# EAGLE board LED-plus20-SHIM (EAGLE 9.6.2), part 1 of 2
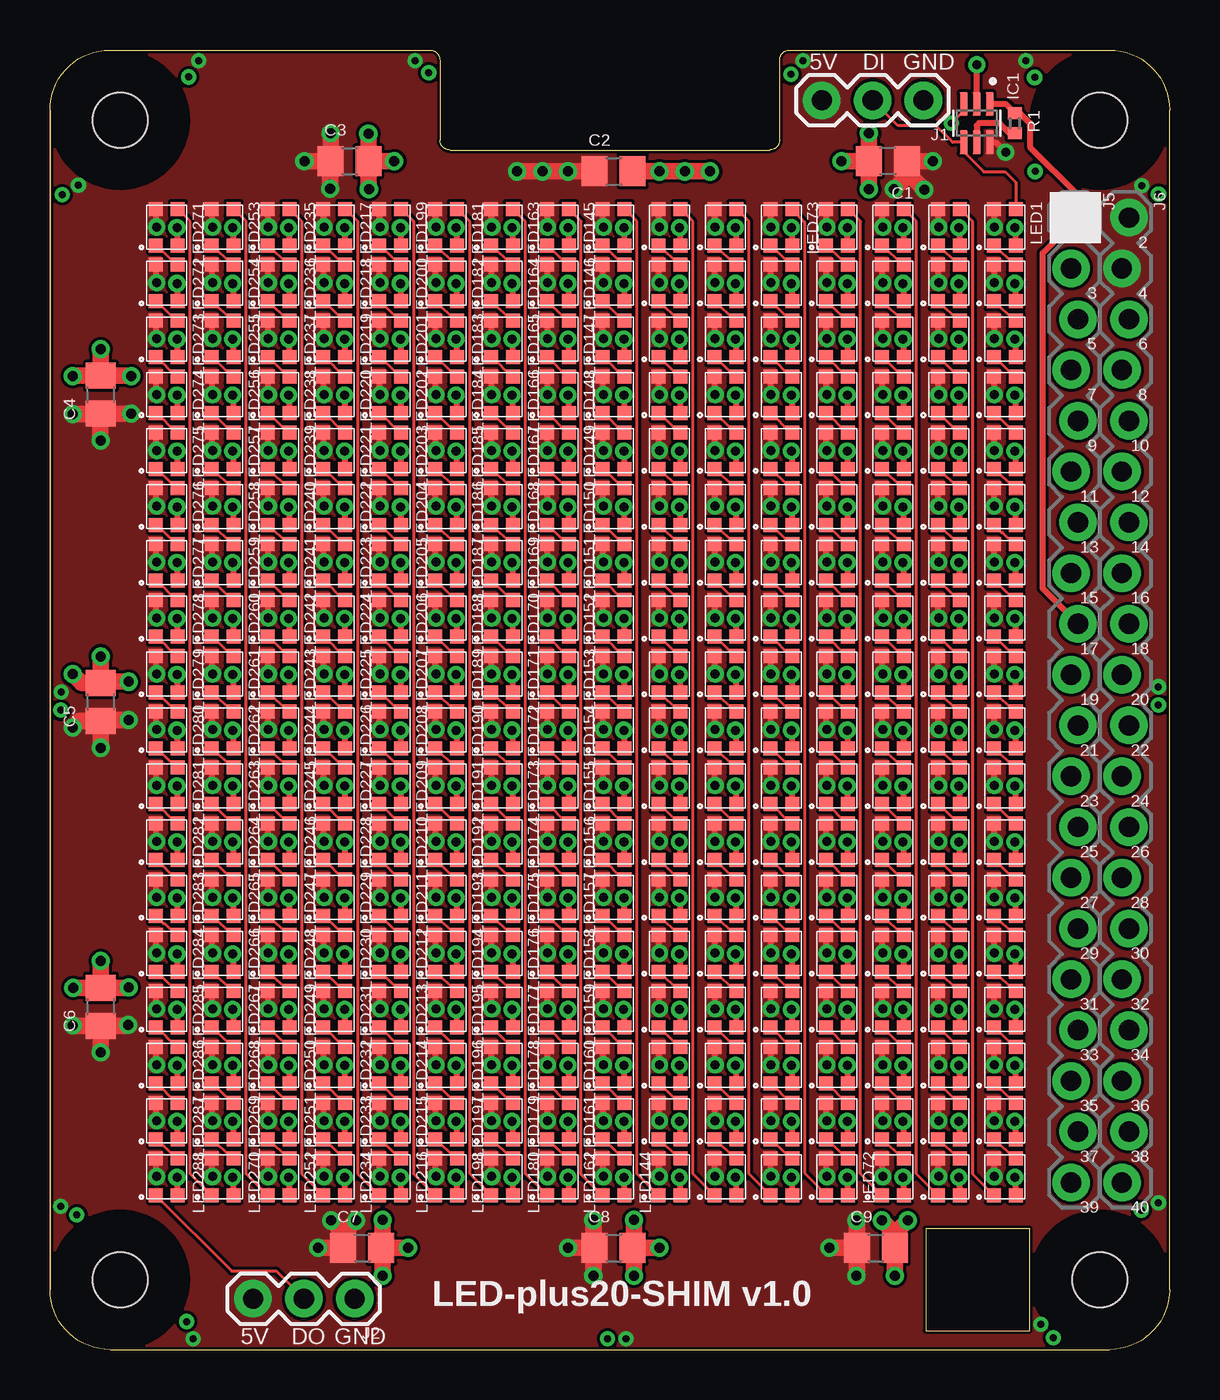
[diagram p4: board, top side]
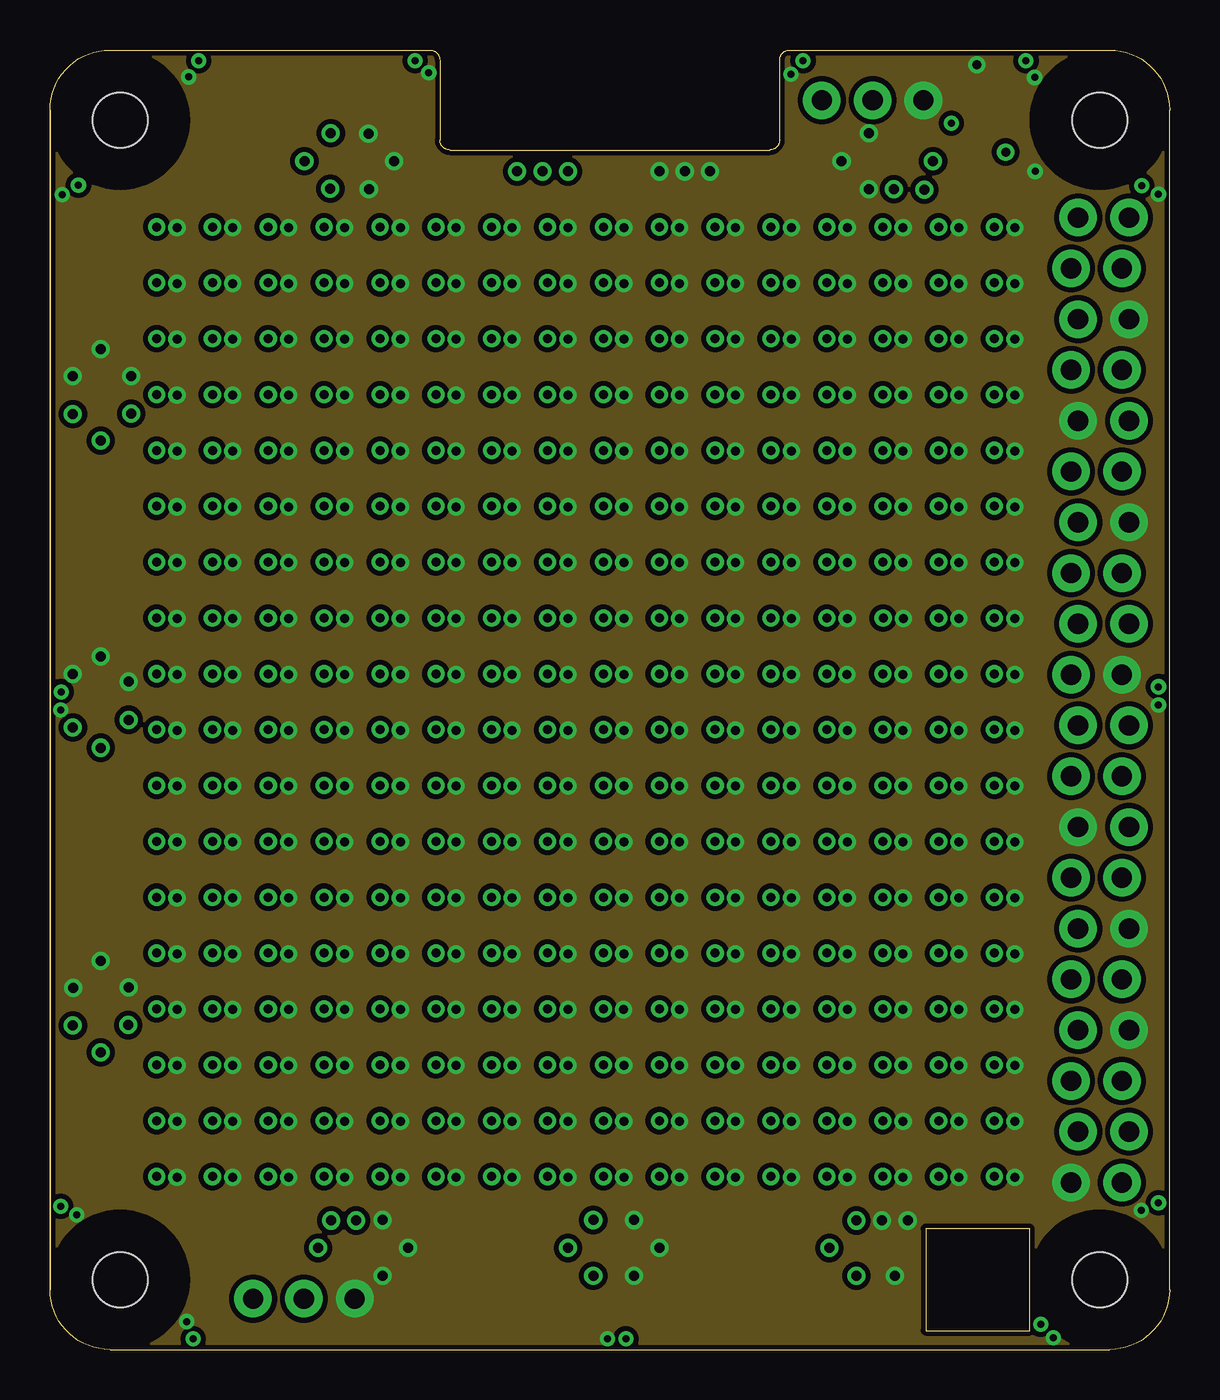
[diagram p5: board, inner layer Route2]
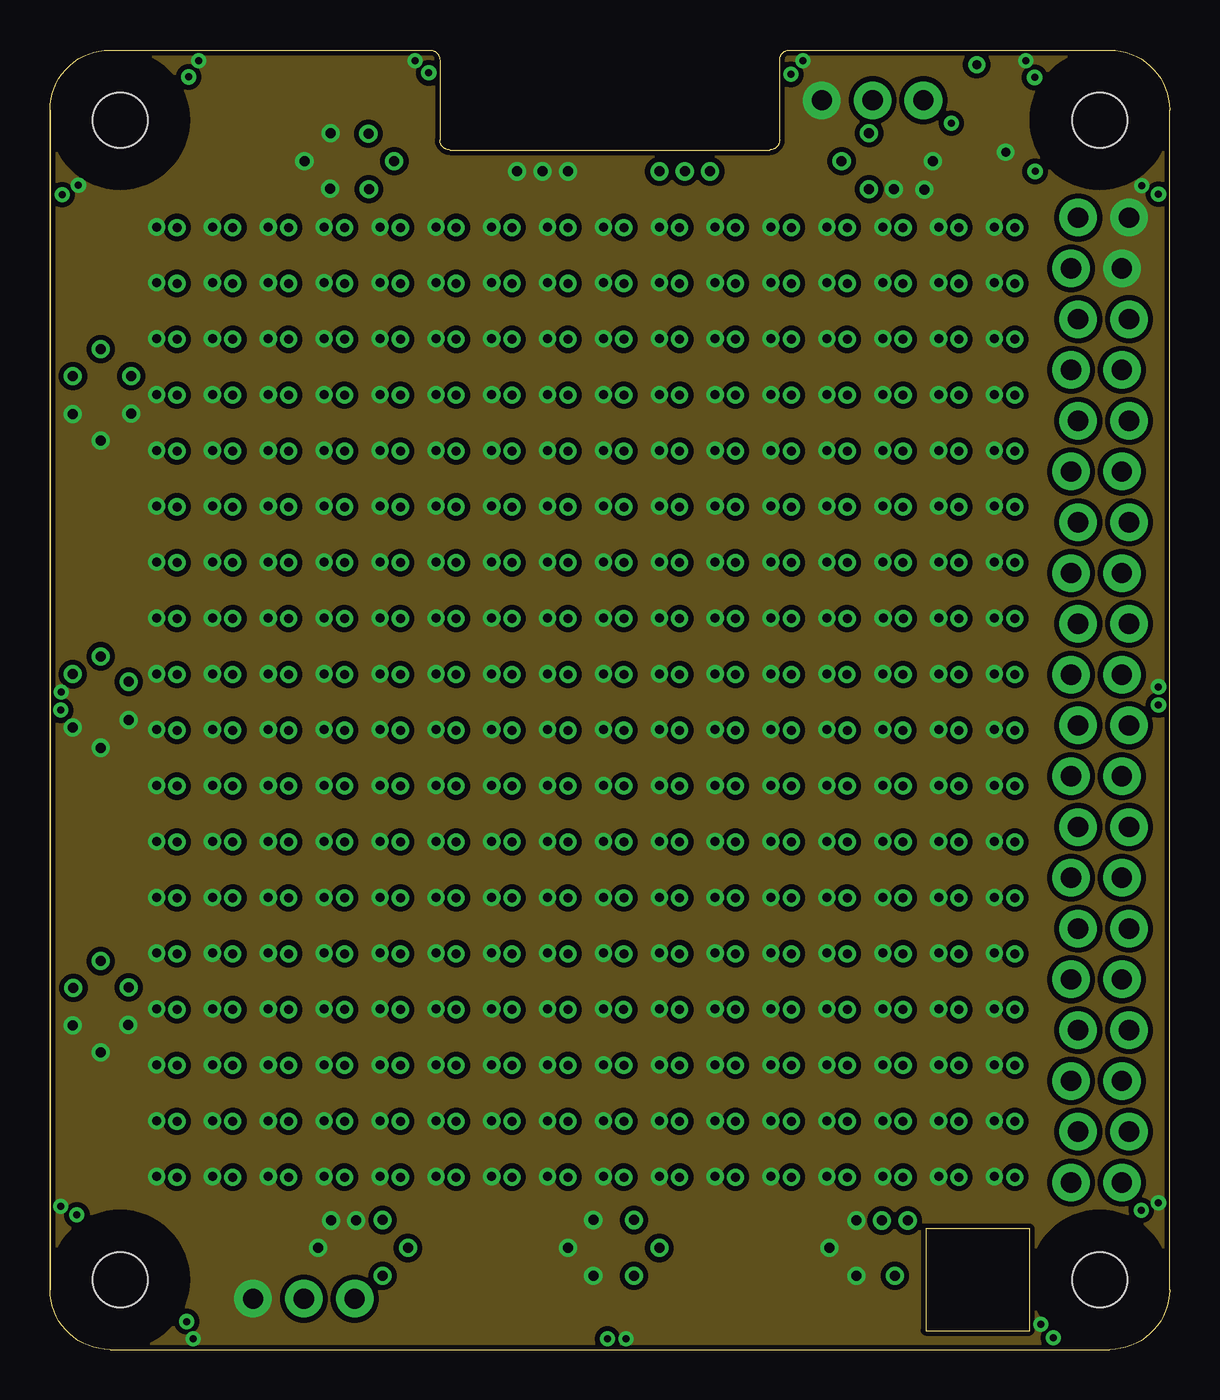
[diagram p6: board, inner layer Route15]
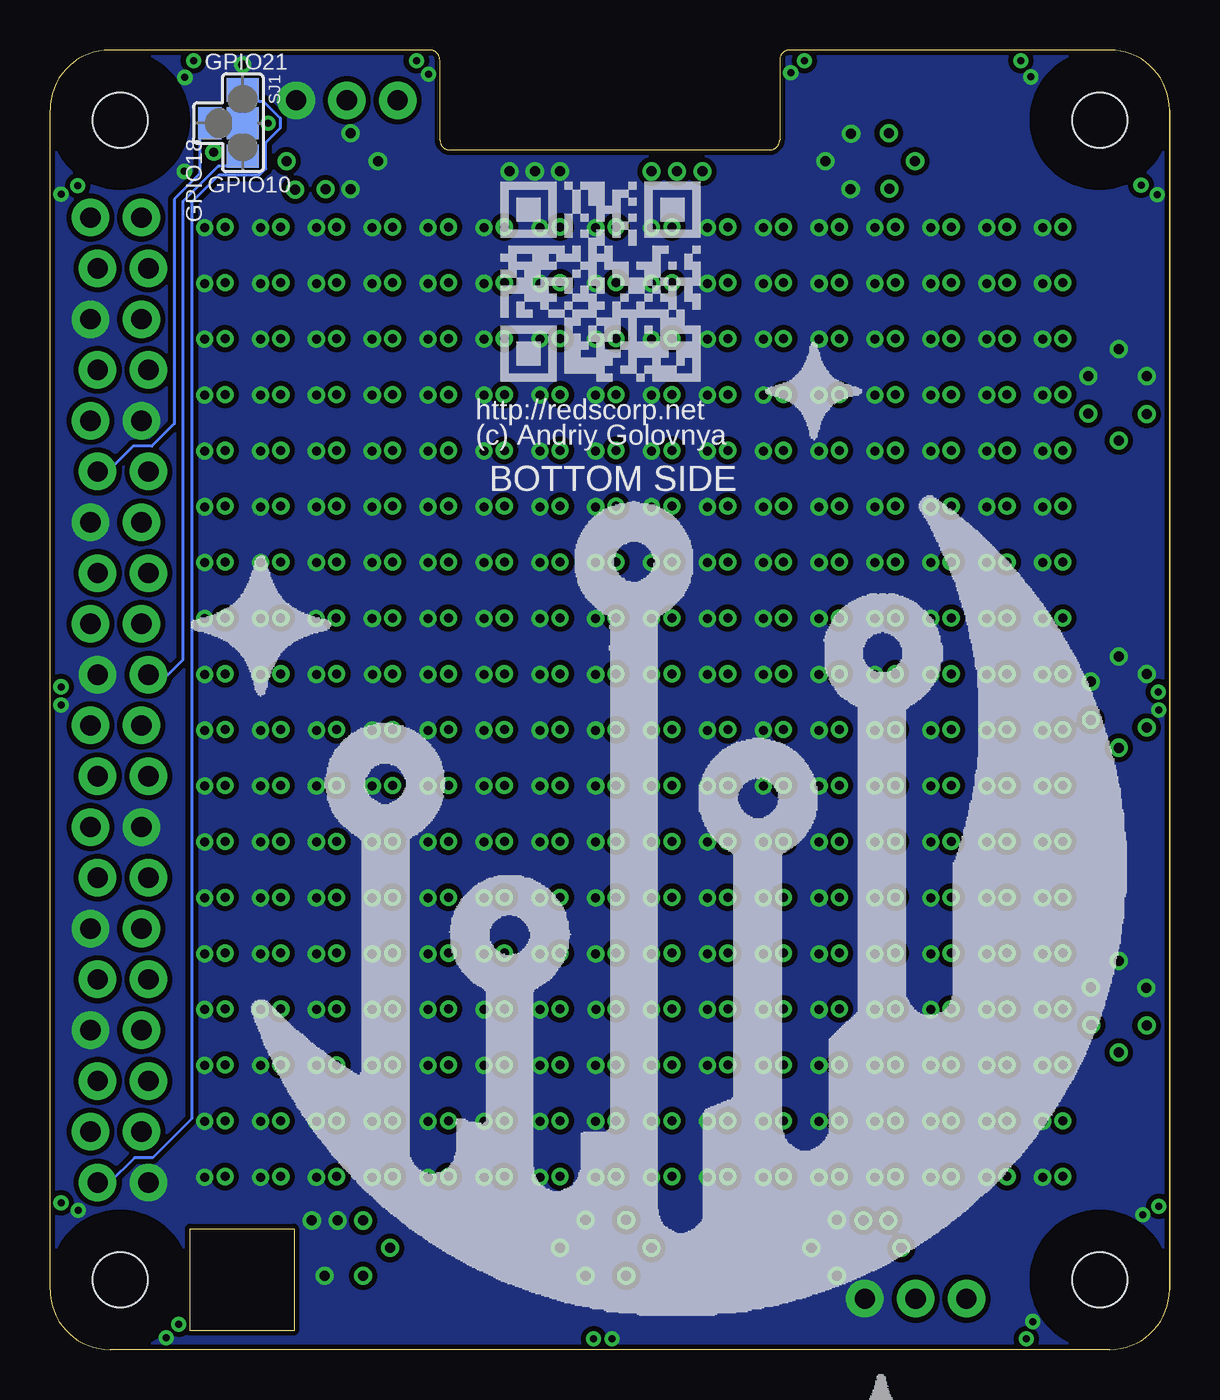
[diagram p7: board, bottom side, seen from below]

Size 56 x 65 mm. Coordinates in mm from the lower left corner, seen from the top.
Outline: 0,3 arc0 0,3 0,62 arc0 0,62
Outline: 0,62 0,3
Outline: 0,3 arc90 3,0 53,0 arc90 56,3 56,62 arc90 53,65 37,65 arc90 36.5,64.5 36.5,60.5 arc-90 36,60 20,60 arc-90 19.5,60.5 19.5,64.5 arc90 19,65 3,65 arc90 0,62
Outline: 43.8,0.95 49,0.95 49,6.05 43.8,6.05 43.8,0.95
Copper layers (1+2*15+16): Top 0.035mm / dielectric 0.2mm / Route2 0.035mm / dielectric 1.5mm / Route15 0.035mm / dielectric 0.2mm / Bottom 0.035mm
Design rules "default *": minimum track width 6mil, minimum drill 0.35mm, track to track 6mil, track to pad 6mil, pad to pad 6mil, via to via 6mil, smd to smd 6mil, copper to edge 6mil, drill to drill 6mil, minimum pad ring 10mil, minimum via ring 8mil, stop-mask expansion 4mil, vias tented up to drill 20mil, thermal gap 10mil
Holes 2.75 mm at 3.5,3.5 52.5,3.5 3.5,61.5 52.5,61.5

## Footprints (pad centres in the part's own frame; a part is rotated, then mirrored left to right if it is on the bottom)
C0805 = smd 1.3 x 1.5: 1 -0.95,0; 2 0.95,0
SOT65P210X110-6N = smd 1.19 x 0.4: 1 -0.96,0.65; 2 -0.96,0; 3 -0.96,-0.65; 4 0.96,-0.65; 5 0.96,0; 6 0.96,0.65
1X03 = drill 1.016 pad 1.88: 1 0,0; 2 2.54,0; 3 5.08,0
1X20_LOCK = drill 1.016 pad 1.88: 1 0,0.178; 2 2.54,-0.178; 3 5.08,0.178; 4 7.62,-0.178; 5 10.16,0.178; 6 12.7,-0.178; 7 15.24,0.178; 8 17.78,-0.178; 9 20.32,0.178; 10 22.86,-0.178; 11 25.4,0.178; 12 27.94,-0.178; 13 30.48,0.178; 14 33.02,-0.178; 15 35.56,0.178; 16 38.1,-0.178; 17 40.64,0.178; 18 43.18,-0.178; 19 45.72,0.178; 20 48.26,-0.178
WS2812X-2020 = smd 0.7 x 0.7: DI -0.915,0.55; DO 0.915,-0.55; GND 0.915,0.55; VDD -0.915,-0.55
R0402 = smd 0.6 x 0.7: 1 -0.5,0; 2 0.5,0
SJ_3 = smd 1.168 x 1.6: 1 -1.651,0; 3 1.651,0 | smd 1.6 x 1.6: 2 0,0 | smd 1.6 x 1.168: 4 0,-1.651

## Placement (x,y rotation side)
C1  10uF  [C0805]  41.91,59.44 180 top
C2  10uF  [C0805]  28.19,58.93 0 top
C3  10uF  [C0805]  14.99,59.44 0 top
C4  10uF  [C0805]  2.54,47.75 90 top
C5  10uF  [C0805]  2.54,32.38 90 top
C6  10uF  [C0805]  2.54,17.14 90 top
C7  10uF  [C0805]  15.62,5.08 0 top
C8  10uF  [C0805]  28.19,5.08 0 top
C9  10uF  [C0805]  41.3,5.08 0 top
IC1  TXB0101DCKR  [SOT65P210X110-6N]  46.36,61.34 270 top
J1  [1X03]  43.69,62.48 180 top
J2  [1X03]  15.24,2.54 180 top
J5  [1X20_LOCK]  51.25,56.62 270 top
J6  [1X20_LOCK]  53.79,56.62 270 top
LED1  WS2812C-2020  [WS2812X-2020]  47.75,56.13 270 top
LED2  WS2812C-2020  [WS2812X-2020]  47.75,53.34 270 top
LED3  WS2812C-2020  [WS2812X-2020]  47.75,50.55 270 top
LED4  WS2812C-2020  [WS2812X-2020]  47.75,47.75 270 top
LED5  WS2812C-2020  [WS2812X-2020]  47.75,44.96 270 top
LED6  WS2812C-2020  [WS2812X-2020]  47.75,42.16 270 top
LED7  WS2812C-2020  [WS2812X-2020]  47.75,39.37 270 top
LED8  WS2812C-2020  [WS2812X-2020]  47.75,36.58 270 top
LED9  WS2812C-2020  [WS2812X-2020]  47.75,33.78 270 top
LED10  WS2812C-2020  [WS2812X-2020]  47.75,30.99 270 top
LED11  WS2812C-2020  [WS2812X-2020]  47.75,28.19 270 top
LED12  WS2812C-2020  [WS2812X-2020]  47.75,25.4 270 top
LED13  WS2812C-2020  [WS2812X-2020]  47.75,22.61 270 top
LED14  WS2812C-2020  [WS2812X-2020]  47.75,19.81 270 top
LED15  WS2812C-2020  [WS2812X-2020]  47.75,17.02 270 top
LED16  WS2812C-2020  [WS2812X-2020]  47.75,14.22 270 top
LED17  WS2812C-2020  [WS2812X-2020]  47.75,11.43 270 top
LED18  WS2812C-2020  [WS2812X-2020]  47.75,8.64 270 top
LED19  WS2812C-2020  [WS2812X-2020]  44.96,56.13 270 top
LED20  WS2812C-2020  [WS2812X-2020]  44.96,53.34 270 top
LED21  WS2812C-2020  [WS2812X-2020]  44.96,50.55 270 top
LED22  WS2812C-2020  [WS2812X-2020]  44.96,47.75 270 top
LED23  WS2812C-2020  [WS2812X-2020]  44.96,44.96 270 top
LED24  WS2812C-2020  [WS2812X-2020]  44.96,42.16 270 top
LED25  WS2812C-2020  [WS2812X-2020]  44.96,39.37 270 top
LED26  WS2812C-2020  [WS2812X-2020]  44.96,36.58 270 top
LED27  WS2812C-2020  [WS2812X-2020]  44.96,33.78 270 top
LED28  WS2812C-2020  [WS2812X-2020]  44.96,30.99 270 top
LED29  WS2812C-2020  [WS2812X-2020]  44.96,28.19 270 top
LED30  WS2812C-2020  [WS2812X-2020]  44.96,25.4 270 top
LED31  WS2812C-2020  [WS2812X-2020]  44.96,22.61 270 top
LED32  WS2812C-2020  [WS2812X-2020]  44.96,19.81 270 top
LED33  WS2812C-2020  [WS2812X-2020]  44.96,17.02 270 top
LED34  WS2812C-2020  [WS2812X-2020]  44.96,14.22 270 top
LED35  WS2812C-2020  [WS2812X-2020]  44.96,11.43 270 top
LED36  WS2812C-2020  [WS2812X-2020]  44.96,8.64 270 top
LED37  WS2812C-2020  [WS2812X-2020]  42.16,56.13 270 top
LED38  WS2812C-2020  [WS2812X-2020]  42.16,53.34 270 top
LED39  WS2812C-2020  [WS2812X-2020]  42.16,50.55 270 top
LED40  WS2812C-2020  [WS2812X-2020]  42.16,47.75 270 top
LED41  WS2812C-2020  [WS2812X-2020]  42.16,44.96 270 top
LED42  WS2812C-2020  [WS2812X-2020]  42.16,42.16 270 top
LED43  WS2812C-2020  [WS2812X-2020]  42.16,39.37 270 top
LED44  WS2812C-2020  [WS2812X-2020]  42.16,36.58 270 top
LED45  WS2812C-2020  [WS2812X-2020]  42.16,33.78 270 top
LED46  WS2812C-2020  [WS2812X-2020]  42.16,30.99 270 top
LED47  WS2812C-2020  [WS2812X-2020]  42.16,28.19 270 top
LED48  WS2812C-2020  [WS2812X-2020]  42.16,25.4 270 top
LED49  WS2812C-2020  [WS2812X-2020]  42.16,22.61 270 top
LED50  WS2812C-2020  [WS2812X-2020]  42.16,19.81 270 top
LED51  WS2812C-2020  [WS2812X-2020]  42.16,17.02 270 top
LED52  WS2812C-2020  [WS2812X-2020]  42.16,14.22 270 top
LED53  WS2812C-2020  [WS2812X-2020]  42.16,11.43 270 top
LED54  WS2812C-2020  [WS2812X-2020]  42.16,8.64 270 top
LED55  WS2812C-2020  [WS2812X-2020]  39.37,56.13 270 top
LED56  WS2812C-2020  [WS2812X-2020]  39.37,53.34 270 top
LED57  WS2812C-2020  [WS2812X-2020]  39.37,50.55 270 top
LED58  WS2812C-2020  [WS2812X-2020]  39.37,47.75 270 top
LED59  WS2812C-2020  [WS2812X-2020]  39.37,44.96 270 top
LED60  WS2812C-2020  [WS2812X-2020]  39.37,42.16 270 top
LED61  WS2812C-2020  [WS2812X-2020]  39.37,39.37 270 top
LED62  WS2812C-2020  [WS2812X-2020]  39.37,36.58 270 top
LED63  WS2812C-2020  [WS2812X-2020]  39.37,33.78 270 top
LED64  WS2812C-2020  [WS2812X-2020]  39.37,30.99 270 top
LED65  WS2812C-2020  [WS2812X-2020]  39.37,28.19 270 top
LED66  WS2812C-2020  [WS2812X-2020]  39.37,25.4 270 top
LED67  WS2812C-2020  [WS2812X-2020]  39.37,22.61 270 top
LED68  WS2812C-2020  [WS2812X-2020]  39.37,19.81 270 top
LED69  WS2812C-2020  [WS2812X-2020]  39.37,17.02 270 top
LED70  WS2812C-2020  [WS2812X-2020]  39.37,14.22 270 top
LED71  WS2812C-2020  [WS2812X-2020]  39.37,11.43 270 top
LED72  WS2812C-2020  [WS2812X-2020]  39.37,8.64 270 top
LED73  WS2812C-2020  [WS2812X-2020]  36.58,56.13 270 top
LED74  WS2812C-2020  [WS2812X-2020]  36.58,53.34 270 top
LED75  WS2812C-2020  [WS2812X-2020]  36.58,50.55 270 top
LED76  WS2812C-2020  [WS2812X-2020]  36.58,47.75 270 top
LED77  WS2812C-2020  [WS2812X-2020]  36.58,44.96 270 top
LED78  WS2812C-2020  [WS2812X-2020]  36.58,42.16 270 top
LED79  WS2812C-2020  [WS2812X-2020]  36.58,39.37 270 top
LED80  WS2812C-2020  [WS2812X-2020]  36.58,36.58 270 top
LED81  WS2812C-2020  [WS2812X-2020]  36.58,33.78 270 top
LED82  WS2812C-2020  [WS2812X-2020]  36.58,30.99 270 top
LED83  WS2812C-2020  [WS2812X-2020]  36.58,28.19 270 top
LED84  WS2812C-2020  [WS2812X-2020]  36.58,25.4 270 top
LED85  WS2812C-2020  [WS2812X-2020]  36.58,22.61 270 top
LED86  WS2812C-2020  [WS2812X-2020]  36.58,19.81 270 top
LED87  WS2812C-2020  [WS2812X-2020]  36.58,17.02 270 top
LED88  WS2812C-2020  [WS2812X-2020]  36.58,14.22 270 top
LED89  WS2812C-2020  [WS2812X-2020]  36.58,11.43 270 top
LED90  WS2812C-2020  [WS2812X-2020]  36.58,8.64 270 top
LED91  WS2812C-2020  [WS2812X-2020]  33.78,56.13 270 top
LED92  WS2812C-2020  [WS2812X-2020]  33.78,53.34 270 top
LED93  WS2812C-2020  [WS2812X-2020]  33.78,50.55 270 top
LED94  WS2812C-2020  [WS2812X-2020]  33.78,47.75 270 top
LED95  WS2812C-2020  [WS2812X-2020]  33.78,44.96 270 top
LED96  WS2812C-2020  [WS2812X-2020]  33.78,42.16 270 top
LED97  WS2812C-2020  [WS2812X-2020]  33.78,39.37 270 top
LED98  WS2812C-2020  [WS2812X-2020]  33.78,36.58 270 top
LED99  WS2812C-2020  [WS2812X-2020]  33.78,33.78 270 top
LED100  WS2812C-2020  [WS2812X-2020]  33.78,30.99 270 top
LED101  WS2812C-2020  [WS2812X-2020]  33.78,28.19 270 top
LED102  WS2812C-2020  [WS2812X-2020]  33.78,25.4 270 top
LED103  WS2812C-2020  [WS2812X-2020]  33.78,22.61 270 top
LED104  WS2812C-2020  [WS2812X-2020]  33.78,19.81 270 top
LED105  WS2812C-2020  [WS2812X-2020]  33.78,17.02 270 top
LED106  WS2812C-2020  [WS2812X-2020]  33.78,14.22 270 top
LED107  WS2812C-2020  [WS2812X-2020]  33.78,11.43 270 top
LED108  WS2812C-2020  [WS2812X-2020]  33.78,8.64 270 top
LED109  WS2812C-2020  [WS2812X-2020]  30.99,56.13 270 top
LED110  WS2812C-2020  [WS2812X-2020]  30.99,53.34 270 top
LED111  WS2812C-2020  [WS2812X-2020]  30.99,50.55 270 top
LED112  WS2812C-2020  [WS2812X-2020]  30.99,47.75 270 top
LED113  WS2812C-2020  [WS2812X-2020]  30.99,44.96 270 top
LED114  WS2812C-2020  [WS2812X-2020]  30.99,42.16 270 top
LED115  WS2812C-2020  [WS2812X-2020]  30.99,39.37 270 top
LED116  WS2812C-2020  [WS2812X-2020]  30.99,36.58 270 top
LED117  WS2812C-2020  [WS2812X-2020]  30.99,33.78 270 top
LED118  WS2812C-2020  [WS2812X-2020]  30.99,30.99 270 top
LED119  WS2812C-2020  [WS2812X-2020]  30.99,28.19 270 top
LED120  WS2812C-2020  [WS2812X-2020]  30.99,25.4 270 top
LED121  WS2812C-2020  [WS2812X-2020]  30.99,22.61 270 top
LED122  WS2812C-2020  [WS2812X-2020]  30.99,19.81 270 top
LED123  WS2812C-2020  [WS2812X-2020]  30.99,17.02 270 top
LED124  WS2812C-2020  [WS2812X-2020]  30.99,14.22 270 top
LED125  WS2812C-2020  [WS2812X-2020]  30.99,11.43 270 top
LED126  WS2812C-2020  [WS2812X-2020]  30.99,8.64 270 top
LED127  WS2812C-2020  [WS2812X-2020]  28.19,56.13 270 top
LED128  WS2812C-2020  [WS2812X-2020]  28.19,53.34 270 top
LED129  WS2812C-2020  [WS2812X-2020]  28.19,50.55 270 top
LED130  WS2812C-2020  [WS2812X-2020]  28.19,47.75 270 top
LED131  WS2812C-2020  [WS2812X-2020]  28.19,44.96 270 top
LED132  WS2812C-2020  [WS2812X-2020]  28.19,42.16 270 top
LED133  WS2812C-2020  [WS2812X-2020]  28.19,39.37 270 top
LED134  WS2812C-2020  [WS2812X-2020]  28.19,36.58 270 top
LED135  WS2812C-2020  [WS2812X-2020]  28.19,33.78 270 top
LED136  WS2812C-2020  [WS2812X-2020]  28.19,30.99 270 top
LED137  WS2812C-2020  [WS2812X-2020]  28.19,28.19 270 top
LED138  WS2812C-2020  [WS2812X-2020]  28.19,25.4 270 top
LED139  WS2812C-2020  [WS2812X-2020]  28.19,22.61 270 top
LED140  WS2812C-2020  [WS2812X-2020]  28.19,19.81 270 top
LED141  WS2812C-2020  [WS2812X-2020]  28.19,17.02 270 top
LED142  WS2812C-2020  [WS2812X-2020]  28.19,14.22 270 top
LED143  WS2812C-2020  [WS2812X-2020]  28.19,11.43 270 top
LED144  WS2812C-2020  [WS2812X-2020]  28.19,8.64 270 top
LED145  WS2812C-2020  [WS2812X-2020]  25.4,56.13 270 top
LED146  WS2812C-2020  [WS2812X-2020]  25.4,53.34 270 top
LED147  WS2812C-2020  [WS2812X-2020]  25.4,50.55 270 top
LED148  WS2812C-2020  [WS2812X-2020]  25.4,47.75 270 top
LED149  WS2812C-2020  [WS2812X-2020]  25.4,44.96 270 top
LED150  WS2812C-2020  [WS2812X-2020]  25.4,42.16 270 top
LED151  WS2812C-2020  [WS2812X-2020]  25.4,39.37 270 top
LED152  WS2812C-2020  [WS2812X-2020]  25.4,36.58 270 top
LED153  WS2812C-2020  [WS2812X-2020]  25.4,33.78 270 top
LED154  WS2812C-2020  [WS2812X-2020]  25.4,30.99 270 top
LED155  WS2812C-2020  [WS2812X-2020]  25.4,28.19 270 top
LED156  WS2812C-2020  [WS2812X-2020]  25.4,25.4 270 top
LED157  WS2812C-2020  [WS2812X-2020]  25.4,22.61 270 top
LED158  WS2812C-2020  [WS2812X-2020]  25.4,19.81 270 top
LED159  WS2812C-2020  [WS2812X-2020]  25.4,17.02 270 top
LED160  WS2812C-2020  [WS2812X-2020]  25.4,14.22 270 top
LED161  WS2812C-2020  [WS2812X-2020]  25.4,11.43 270 top
LED162  WS2812C-2020  [WS2812X-2020]  25.4,8.64 270 top
LED163  WS2812C-2020  [WS2812X-2020]  22.61,56.13 270 top
LED164  WS2812C-2020  [WS2812X-2020]  22.61,53.34 270 top
LED165  WS2812C-2020  [WS2812X-2020]  22.61,50.55 270 top
LED166  WS2812C-2020  [WS2812X-2020]  22.61,47.75 270 top
LED167  WS2812C-2020  [WS2812X-2020]  22.61,44.96 270 top
LED168  WS2812C-2020  [WS2812X-2020]  22.61,42.16 270 top
LED169  WS2812C-2020  [WS2812X-2020]  22.61,39.37 270 top
LED170  WS2812C-2020  [WS2812X-2020]  22.61,36.58 270 top
LED171  WS2812C-2020  [WS2812X-2020]  22.61,33.78 270 top
LED172  WS2812C-2020  [WS2812X-2020]  22.61,30.99 270 top
LED173  WS2812C-2020  [WS2812X-2020]  22.61,28.19 270 top
LED174  WS2812C-2020  [WS2812X-2020]  22.61,25.4 270 top
LED175  WS2812C-2020  [WS2812X-2020]  22.61,22.61 270 top
LED176  WS2812C-2020  [WS2812X-2020]  22.61,19.81 270 top
LED177  WS2812C-2020  [WS2812X-2020]  22.61,17.02 270 top
LED178  WS2812C-2020  [WS2812X-2020]  22.61,14.22 270 top
LED179  WS2812C-2020  [WS2812X-2020]  22.61,11.43 270 top
LED180  WS2812C-2020  [WS2812X-2020]  22.61,8.64 270 top
LED181  WS2812C-2020  [WS2812X-2020]  19.81,56.13 270 top
LED182  WS2812C-2020  [WS2812X-2020]  19.81,53.34 270 top
LED183  WS2812C-2020  [WS2812X-2020]  19.81,50.55 270 top
LED184  WS2812C-2020  [WS2812X-2020]  19.81,47.75 270 top
LED185  WS2812C-2020  [WS2812X-2020]  19.81,44.96 270 top
LED186  WS2812C-2020  [WS2812X-2020]  19.81,42.16 270 top
LED187  WS2812C-2020  [WS2812X-2020]  19.81,39.37 270 top
LED188  WS2812C-2020  [WS2812X-2020]  19.81,36.58 270 top
LED189  WS2812C-2020  [WS2812X-2020]  19.81,33.78 270 top
LED190  WS2812C-2020  [WS2812X-2020]  19.81,30.99 270 top
LED191  WS2812C-2020  [WS2812X-2020]  19.81,28.19 270 top
LED192  WS2812C-2020  [WS2812X-2020]  19.81,25.4 270 top
LED193  WS2812C-2020  [WS2812X-2020]  19.81,22.61 270 top
LED194  WS2812C-2020  [WS2812X-2020]  19.81,19.81 270 top
LED195  WS2812C-2020  [WS2812X-2020]  19.81,17.02 270 top
LED196  WS2812C-2020  [WS2812X-2020]  19.81,14.22 270 top
LED197  WS2812C-2020  [WS2812X-2020]  19.81,11.43 270 top
LED198  WS2812C-2020  [WS2812X-2020]  19.81,8.64 270 top
LED199  WS2812C-2020  [WS2812X-2020]  17.02,56.13 270 top
LED200  WS2812C-2020  [WS2812X-2020]  17.02,53.34 270 top
LED201  WS2812C-2020  [WS2812X-2020]  17.02,50.55 270 top
LED202  WS2812C-2020  [WS2812X-2020]  17.02,47.75 270 top
LED203  WS2812C-2020  [WS2812X-2020]  17.02,44.96 270 top
LED204  WS2812C-2020  [WS2812X-2020]  17.02,42.16 270 top
LED205  WS2812C-2020  [WS2812X-2020]  17.02,39.37 270 top
LED206  WS2812C-2020  [WS2812X-2020]  17.02,36.58 270 top
LED207  WS2812C-2020  [WS2812X-2020]  17.02,33.78 270 top
LED208  WS2812C-2020  [WS2812X-2020]  17.02,30.99 270 top
LED209  WS2812C-2020  [WS2812X-2020]  17.02,28.19 270 top
LED210  WS2812C-2020  [WS2812X-2020]  17.02,25.4 270 top
LED211  WS2812C-2020  [WS2812X-2020]  17.02,22.61 270 top
LED212  WS2812C-2020  [WS2812X-2020]  17.02,19.81 270 top
LED213  WS2812C-2020  [WS2812X-2020]  17.02,17.02 270 top
LED214  WS2812C-2020  [WS2812X-2020]  17.02,14.22 270 top
LED215  WS2812C-2020  [WS2812X-2020]  17.02,11.43 270 top
LED216  WS2812C-2020  [WS2812X-2020]  17.02,8.64 270 top
LED217  WS2812C-2020  [WS2812X-2020]  14.22,56.13 270 top
LED218  WS2812C-2020  [WS2812X-2020]  14.22,53.34 270 top
LED219  WS2812C-2020  [WS2812X-2020]  14.22,50.55 270 top
LED220  WS2812C-2020  [WS2812X-2020]  14.22,47.75 270 top
LED221  WS2812C-2020  [WS2812X-2020]  14.22,44.96 270 top
LED222  WS2812C-2020  [WS2812X-2020]  14.22,42.16 270 top
LED223  WS2812C-2020  [WS2812X-2020]  14.22,39.37 270 top
LED224  WS2812C-2020  [WS2812X-2020]  14.22,36.58 270 top
LED225  WS2812C-2020  [WS2812X-2020]  14.22,33.78 270 top
LED226  WS2812C-2020  [WS2812X-2020]  14.22,30.99 270 top
LED227  WS2812C-2020  [WS2812X-2020]  14.22,28.19 270 top
LED228  WS2812C-2020  [WS2812X-2020]  14.22,25.4 270 top
LED229  WS2812C-2020  [WS2812X-2020]  14.22,22.61 270 top
LED230  WS2812C-2020  [WS2812X-2020]  14.22,19.81 270 top
LED231  WS2812C-2020  [WS2812X-2020]  14.22,17.02 270 top
LED232  WS2812C-2020  [WS2812X-2020]  14.22,14.22 270 top
LED233  WS2812C-2020  [WS2812X-2020]  14.22,11.43 270 top
LED234  WS2812C-2020  [WS2812X-2020]  14.22,8.64 270 top
LED235  WS2812C-2020  [WS2812X-2020]  11.43,56.13 270 top
LED236  WS2812C-2020  [WS2812X-2020]  11.43,53.34 270 top
LED237  WS2812C-2020  [WS2812X-2020]  11.43,50.55 270 top
LED238  WS2812C-2020  [WS2812X-2020]  11.43,47.75 270 top
LED239  WS2812C-2020  [WS2812X-2020]  11.43,44.96 270 top
LED240  WS2812C-2020  [WS2812X-2020]  11.43,42.16 270 top
LED241  WS2812C-2020  [WS2812X-2020]  11.43,39.37 270 top
LED242  WS2812C-2020  [WS2812X-2020]  11.43,36.58 270 top
LED243  WS2812C-2020  [WS2812X-2020]  11.43,33.78 270 top
LED244  WS2812C-2020  [WS2812X-2020]  11.43,30.99 270 top
LED245  WS2812C-2020  [WS2812X-2020]  11.43,28.19 270 top
LED246  WS2812C-2020  [WS2812X-2020]  11.43,25.4 270 top
LED247  WS2812C-2020  [WS2812X-2020]  11.43,22.61 270 top
LED248  WS2812C-2020  [WS2812X-2020]  11.43,19.81 270 top
LED249  WS2812C-2020  [WS2812X-2020]  11.43,17.02 270 top
LED250  WS2812C-2020  [WS2812X-2020]  11.43,14.22 270 top
LED251  WS2812C-2020  [WS2812X-2020]  11.43,11.43 270 top
LED252  WS2812C-2020  [WS2812X-2020]  11.43,8.64 270 top
LED253  WS2812C-2020  [WS2812X-2020]  8.64,56.13 270 top
LED254  WS2812C-2020  [WS2812X-2020]  8.64,53.34 270 top
LED255  WS2812C-2020  [WS2812X-2020]  8.64,50.55 270 top
LED256  WS2812C-2020  [WS2812X-2020]  8.64,47.75 270 top
LED257  WS2812C-2020  [WS2812X-2020]  8.64,44.96 270 top
LED258  WS2812C-2020  [WS2812X-2020]  8.64,42.16 270 top
LED259  WS2812C-2020  [WS2812X-2020]  8.64,39.37 270 top
LED260  WS2812C-2020  [WS2812X-2020]  8.64,36.58 270 top
LED261  WS2812C-2020  [WS2812X-2020]  8.64,33.78 270 top
LED262  WS2812C-2020  [WS2812X-2020]  8.64,30.99 270 top
LED263  WS2812C-2020  [WS2812X-2020]  8.64,28.19 270 top
LED264  WS2812C-2020  [WS2812X-2020]  8.64,25.4 270 top
LED265  WS2812C-2020  [WS2812X-2020]  8.64,22.61 270 top
LED266  WS2812C-2020  [WS2812X-2020]  8.64,19.81 270 top
LED267  WS2812C-2020  [WS2812X-2020]  8.64,17.02 270 top
LED268  WS2812C-2020  [WS2812X-2020]  8.64,14.22 270 top
LED269  WS2812C-2020  [WS2812X-2020]  8.64,11.43 270 top
LED270  WS2812C-2020  [WS2812X-2020]  8.64,8.64 270 top
LED271  WS2812C-2020  [WS2812X-2020]  5.84,56.13 270 top
LED272  WS2812C-2020  [WS2812X-2020]  5.84,53.34 270 top
LED273  WS2812C-2020  [WS2812X-2020]  5.84,50.55 270 top
LED274  WS2812C-2020  [WS2812X-2020]  5.84,47.75 270 top
LED275  WS2812C-2020  [WS2812X-2020]  5.84,44.96 270 top
LED276  WS2812C-2020  [WS2812X-2020]  5.84,42.16 270 top
LED277  WS2812C-2020  [WS2812X-2020]  5.84,39.37 270 top
LED278  WS2812C-2020  [WS2812X-2020]  5.84,36.58 270 top
LED279  WS2812C-2020  [WS2812X-2020]  5.84,33.78 270 top
LED280  WS2812C-2020  [WS2812X-2020]  5.84,30.99 270 top
LED281  WS2812C-2020  [WS2812X-2020]  5.84,28.19 270 top
LED282  WS2812C-2020  [WS2812X-2020]  5.84,25.4 270 top
LED283  WS2812C-2020  [WS2812X-2020]  5.84,22.61 270 top
LED284  WS2812C-2020  [WS2812X-2020]  5.84,19.81 270 top
LED285  WS2812C-2020  [WS2812X-2020]  5.84,17.02 270 top
LED286  WS2812C-2020  [WS2812X-2020]  5.84,14.22 270 top
LED287  WS2812C-2020  [WS2812X-2020]  5.84,11.43 270 top
LED288  WS2812C-2020  [WS2812X-2020]  5.84,8.64 270 top
LOGO1  MFDECLOGO_L_40MM  [MFDEC_L_40MM]  -1.52,-10.03 90 bottom  (outside the outline)
LOGO3  RSNURL_QR_10MM  [RSNURL_QR_10MM]  33.45,48.42 0 bottom
R1  10K  [R0402]  48.26,61.34 270 top
SJ1  [SJ_3]  46.36,61.34 270 bottom